# EAGLE design LoRa SX1276 Shield (EAGLE 7.7.0)

## Sheet 1 of 2
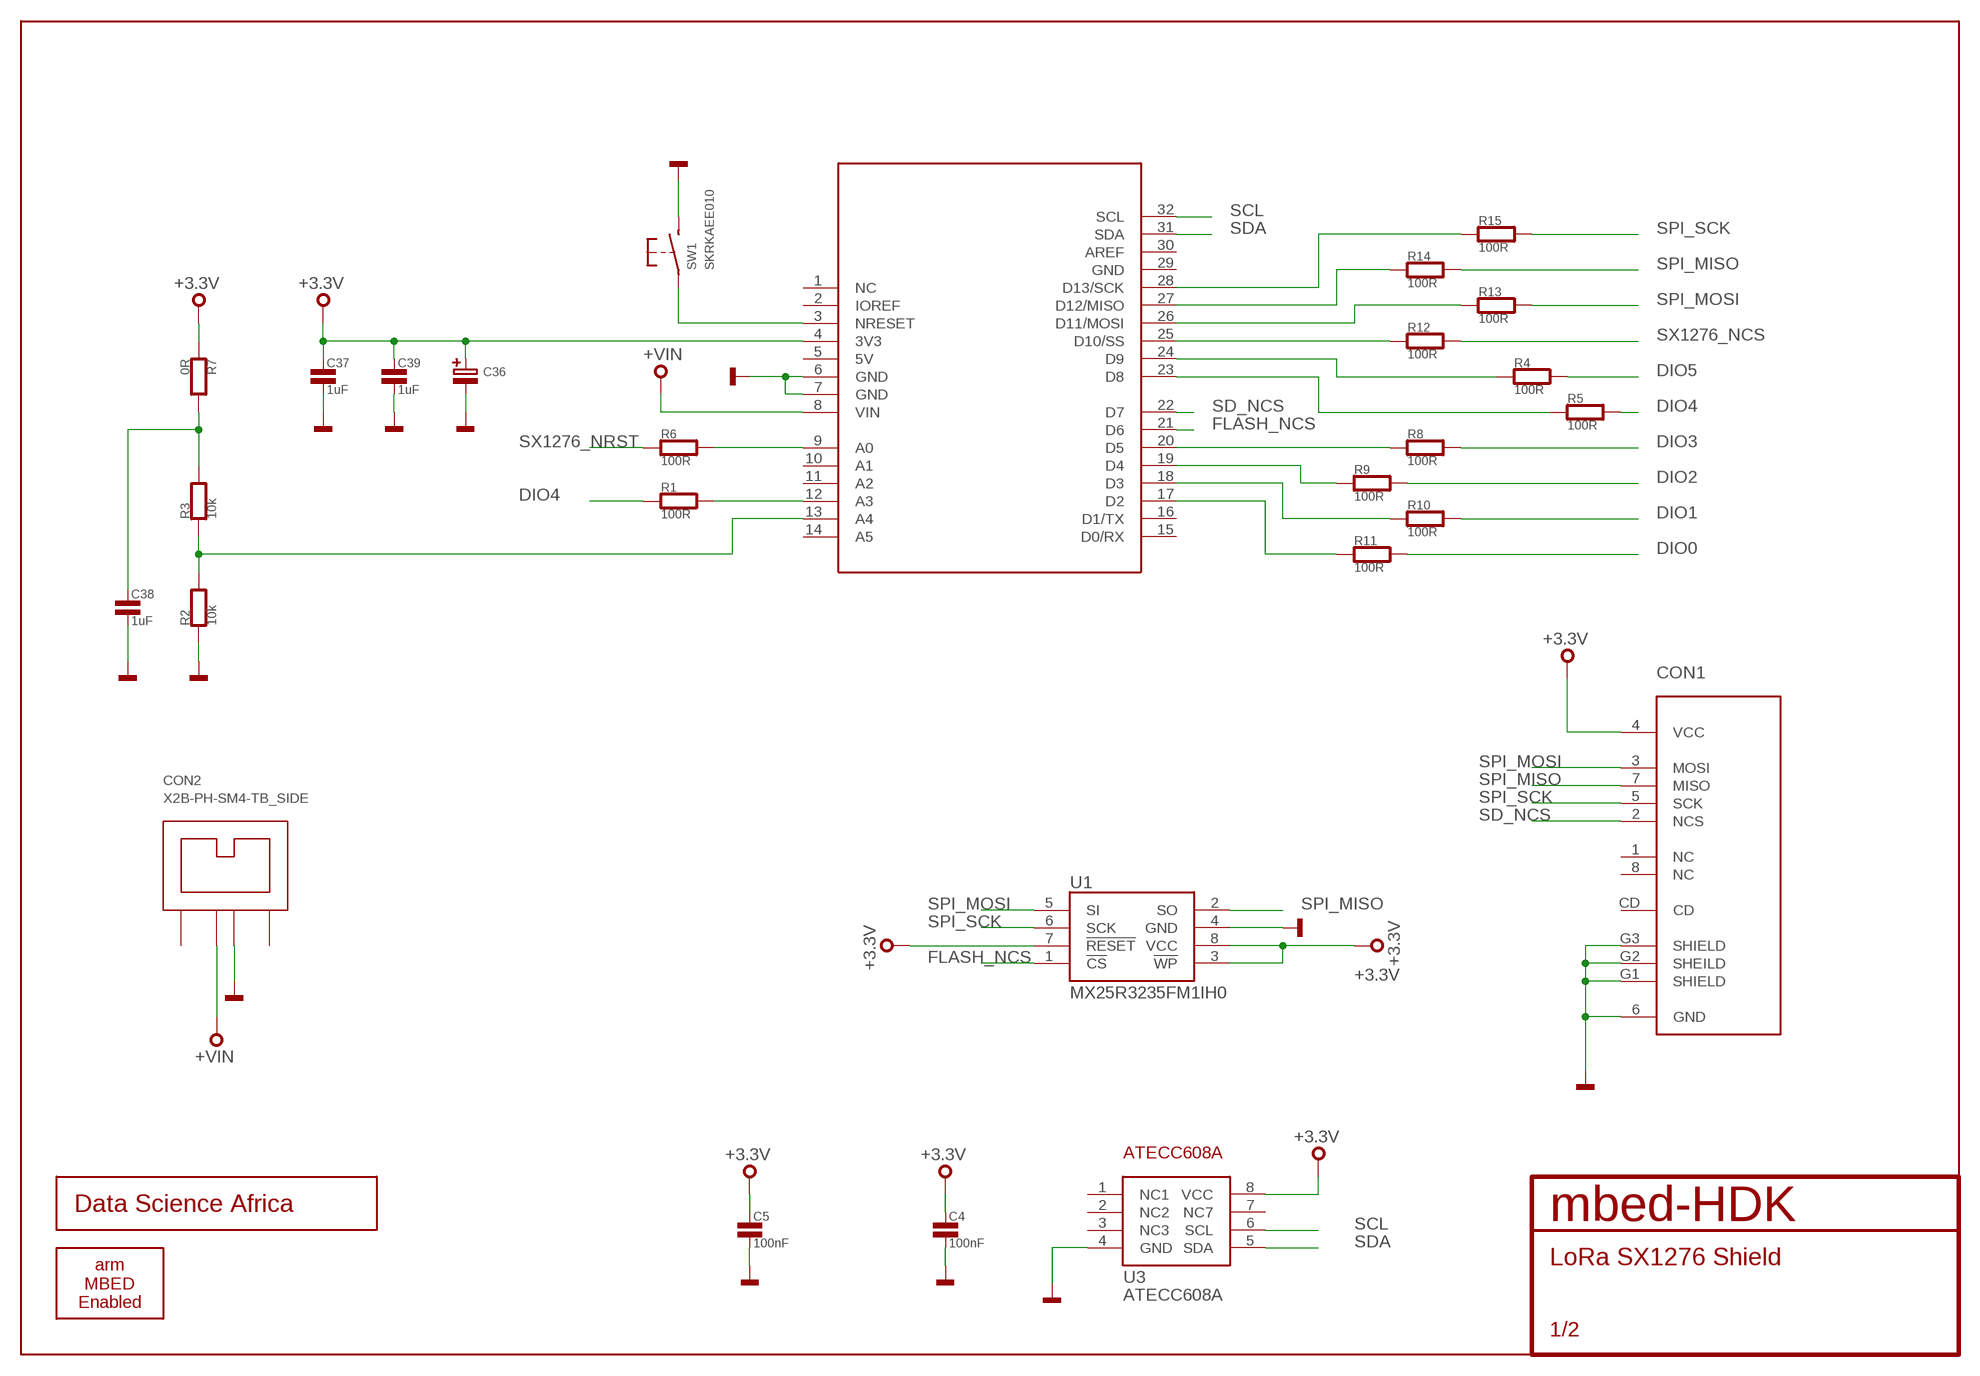
[diagram p0: schematic, sheet 1]

### Parts
BRD2  ARDUINO-R3_APPS  [ARDUINO-R3-APPS-SHEILD]
C4  100nF  C0402  [0402]
C5  100nF  C0402  [0402]
C36  C-POLB  [SMC_B]
C37  1uF  C0603  [0603]
C38  1uF  C0603  [0603]
C39  1uF  C0402  [0402]
CON1  101-00660-68-6  [AMPHENOL-101-00660-68-6]
CON2  X2B-PH-SM4-TB_SIDE  [S2B-PH-SM4-TB]
R1  100R  R0402  [0402]
R2  10k  R0402  [0402]
R3  10k  R0402  [0402]
R4  100R  R0402  [0402]
R5  100R  R0402  [0402]
R6  100R  R0402  [0402]
R7  0R  R0402  [0402]
R8  100R  R0402  [0402]
R9  100R  R0402  [0402]
R10  100R  R0402  [0402]
R11  100R  R0402  [0402]
R12  100R  R0402  [0402]
R13  100R  R0402  [0402]
R14  100R  R0402  [0402]
R15  100R  R0402  [0402]
SS1  ARM-MBED-ENABLED-12MM  [ARM-MBED-ENABLED-12MM]
SS2  DATA-SCIENCE-AFRICA  [DATA-SCIENCE-AFRICA]
SW1  SKRKAEE010  [SKRKAEE010]
U1  MX25R3235FM1IH0  [SO8]
U3  ATECC608A  [SO8]

### Nets
+3.3V: BRD2.4(3V3) C4.1 C5.1 C36.+ C37.1 C39.1 CON1.4(VCC) R7.1 U1.3(!WP) U1.7(!RESET) U1.8(VCC) U3.8(VCC) ; also sheet 2
+VIN: BRD2.8(VIN) CON2.P$1
DIO0: R11.2 ; also sheet 2
DIO1: R10.2 ; also sheet 2
DIO2: R9.2 ; also sheet 2
DIO3: R8.2 ; also sheet 2
DIO4: R1.1 R5.2 ; also sheet 2
DIO5: R4.2 ; also sheet 2
FLASH_NCS: BRD2.21(D6) U1.1(!CS)
GND: BRD2.6(GND) BRD2.7(GND) C4.2 C5.2 C36.- C37.2 C38.2 C39.2 CON1.6(GND) CON1.G1(SHIELD) CON1.G2(SHEILD) CON1.G3(SHIELD) CON2.P$2 R2.1 SW1.P$2(S) U1.4(GND) U3.4(GND) ; also sheet 2
N$11: BRD2.27(D12/MISO) R14.1
N$13: BRD2.26(D11/MOSI) R13.1
N$14: BRD2.25(D10/SS) R12.1
N$17: BRD2.28(D13/SCK) R15.1
N$26: BRD2.9(A0) R6.2
N$27: BRD2.13(A4) R2.2 R3.1
N$28: BRD2.12(A3) R1.2
N$29: BRD2.3(NRESET) SW1.P$1(P)
N$30: BRD2.19(D4) R9.1
N$31: BRD2.18(D3) R10.1
N$32: BRD2.17(D2) R11.1
N$33: BRD2.20(D5) R8.1
N$34: BRD2.24(D9) R4.1
N$35: BRD2.23(D8) R5.1
N$39: C38.1 R3.2 R7.2
SCL: BRD2.32(SCL) U3.6(SCL)
SD_NCS: BRD2.22(D7) CON1.2(NCS)
SDA: BRD2.31(SDA) U3.5(SDA)
SPI_MISO: CON1.7(MISO) R14.2 U1.2(SO) ; also sheet 2
SPI_MOSI: CON1.3(MOSI) R13.2 U1.5(SI) ; also sheet 2
SPI_SCK: CON1.5(SCK) R15.2 U1.6(SCK) ; also sheet 2
SX1276_NCS: R12.2 ; also sheet 2
SX1276_NRST: R6.1 ; also sheet 2
Unconnected: BRD2.1(NC) BRD2.2(IOREF) BRD2.5(5V) BRD2.10(A1) BRD2.11(A2) BRD2.14(A5) BRD2.15(D0/RX) BRD2.16(D1/TX) BRD2.29(GND) BRD2.30(AREF) CON1.1(NC) CON1.8(NC) CON1.CD CON2.G1 CON2.G2 U3.1(NC1) U3.2(NC2) U3.3(NC3) U3.7(NC7)

## Sheet 2 of 2
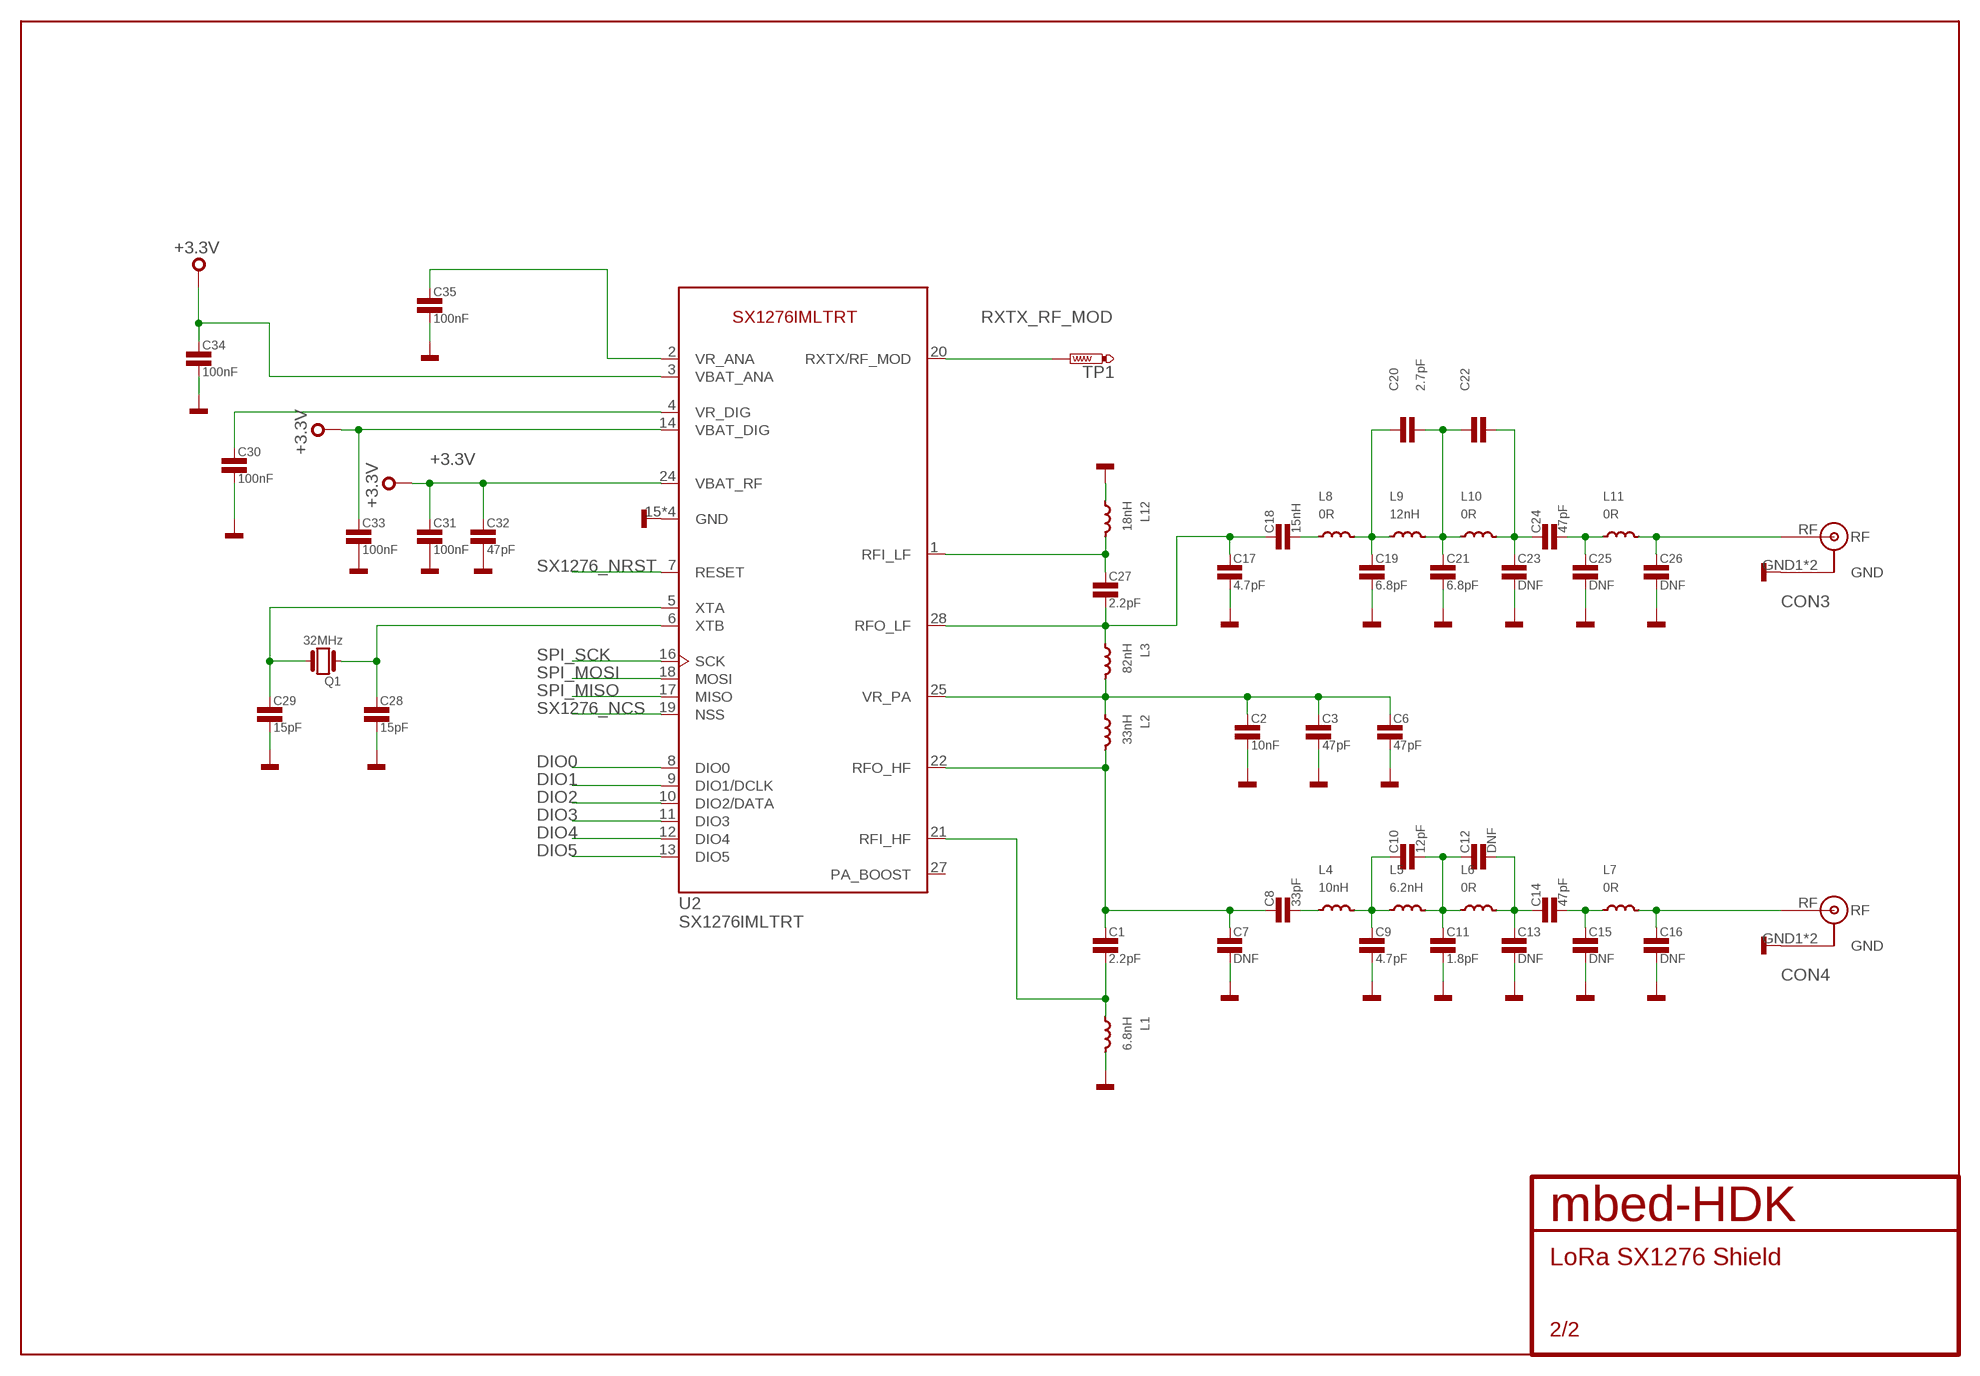
[diagram p1: schematic, sheet 2]

### Parts
C1  2.2pF  C0402  [0402]
C2  10nF  C0402  [0402]
C3  47pF  C0402  [0402]
C6  47pF  C0402  [0402]
C7  DNF  C0402  [0402]
C8  33pF  C0402  [0402]
C9  4.7pF  C0402  [0402]
C10  12pF  C0402  [0402]
C11  1.8pF  C0402  [0402]
C12  DNF  C0402  [0402]
C13  DNF  C0402  [0402]
C14  47pF  C0402  [0402]
C15  DNF  C0402  [0402]
C16  DNF  C0402  [0402]
C17  4.7pF  C0402  [0402]
C18  15nH  C0402  [0402]
C19  6.8pF  C0402  [0402]
C20  2.7pF  C0402  [0402]
C21  6.8pF  C0402  [0402]
C22  C0402  [0402]
C23  DNF  C0402  [0402]
C24  47pF  C0402  [0402]
C25  DNF  C0402  [0402]
C26  DNF  C0402  [0402]
C27  2.2pF  C0402  [0402]
C28  15pF  C0402  [0402]
C29  15pF  C0402  [0402]
C30  100nF  C0402  [0402]
C31  100nF  C0402  [0402]
C32  47pF  C0402  [0402]
C33  100nF  C0402  [0402]
C34  100nF  C0402  [0402]
C35  100nF  C0402  [0402]
CON3  U.FL  [U.FL-R-SMT-1]
CON4  U.FL  [U.FL-R-SMT-1]
L1  6.8nH  L0402  [0402]
L2  33nH  L0402  [0402]
L3  82nH  L0402  [0402]
L4  10nH  L0402  [0402]
L5  6.2nH  L0402  [0402]
L6  0R  L0402  [0402]
L7  0R  L0402  [0402]
L8  0R  L0402  [0402]
L9  12nH  L0402  [0402]
L10  0R  L0402  [0402]
L11  0R  L0402  [0402]
L12  18nH  L0402  [0402]
Q1  32MHz  GENERIC-CRYSTAL_3.2X2.5  [3.2X.2.5]
TP1  PTR1TP12R  [TP12R]
U2  SX1276IMLTRT  [QFN65P600X600X100-29N]

### Nets
+3.3V: C31.1 C32.1 C33.1 C34.1 U2.3(VBAT_ANA) U2.14(VBAT_DIG) U2.24(VBAT_RF) ; also sheet 1
DIO0: U2.8(DIO0) ; also sheet 1
DIO1: U2.9(DIO1/DCLK) ; also sheet 1
DIO2: U2.10(DIO2/DATA) ; also sheet 1
DIO3: U2.11(DIO3) ; also sheet 1
DIO4: U2.12(DIO4) ; also sheet 1
DIO5: U2.13(DIO5) ; also sheet 1
GND: C2.2 C3.2 C6.2 C7.2 C9.2 C11.2 C13.2 C15.2 C16.2 C17.2 C19.2 C21.2 C23.2 C25.2 C26.2 C28.2 C29.2 C30.2 C31.2 C32.2 C33.2 C34.2 C35.2 CON3.GND1(GND) CON3.GND2(GND) CON4.GND1(GND) CON4.GND2(GND) L1.2 L12.1 U2.15(GND) U2.23(GND) U2.26(GND) U2.29(GND) ; also sheet 1
N$1: C1.1 C7.1 C8.1 L2.2 U2.22(RFO_HF)
N$2: C1.2 L1.1 U2.21(RFI_HF)
N$3: C29.1 Q1.P$3 U2.5(XTA)
N$4: C2.1 C3.1 C6.1 L2.1 L3.2 U2.25(VR_PA)
N$5: C27.1 L12.2 U2.1(RFI_LF)
N$6: C8.2 L4.1
N$7: C9.1 C10.1 L4.2 L5.1
N$8: C28.1 Q1.P$1 U2.6(XTB)
N$9: C30.1 U2.4(VR_DIG)
N$10: C10.2 C11.1 C12.1 L5.2 L6.1
N$12: C12.2 C13.1 C14.1 L6.2
N$15: C14.2 C15.1 L7.1
N$16: C16.1 CON4.RF L7.2
N$18: C35.1 U2.2(VR_ANA)
N$19: C17.1 C18.1 C27.2 L3.1 U2.28(RFO_LF)
N$20: C18.2 L8.1
N$21: C19.1 C20.1 L8.2 L9.1
N$22: C20.2 C21.1 C22.1 L9.2 L10.1
N$23: C22.2 C23.1 C24.1 L10.2
N$24: C24.2 C25.1 L11.1
N$25: C26.1 CON3.RF L11.2
RXTX_RF_MOD: TP1.TP U2.20(RXTX/RF_MOD)
SPI_MISO: U2.17(MISO) ; also sheet 1
SPI_MOSI: U2.18(MOSI) ; also sheet 1
SPI_SCK: U2.16(SCK) ; also sheet 1
SX1276_NCS: U2.19(NSS) ; also sheet 1
SX1276_NRST: U2.7(RESET) ; also sheet 1
Unconnected: U2.27(PA_BOOST)

## Library data of the parts
BRD2 = mbed-HDK-misc-Board:ARDUINO-R3: Shield for Arduino R3
C1-C35 C37-C39 = mbed-HDK-RLC:C: Capacitor
C36 = mbed-HDK-RLC:C-POL: Polarised capacitor; MF: Kemet; MFN: T491B106K020AT; OC-DIGIKEY: 399-8298-1-ND; OC-MOUSER: 80-T491B106K020; OC-NEWARK: 57K1740
CON1 = mbed-HDK-Connector:101-00660-68-6: Micro SD PUSH-PUSH; MF: Amphenol; MFN: 101-00660-68-6; OC-DIGIKEY: 101-00660-68-6-1-ND; OC-MOUSER: 523-101-00660-68-6; OC-NEWARK: 47X3171
CON2 = mbed-HDK:X2B-PH-SM4-TB
CON3 CON4 = mbed-HDK-Connector:U.FL
L1-L12 = mbed-HDK-RLC:L: Inductor
Q1 = mbed-HDK-Oscillator:GENERIC-CRYSTAL: GENERIC Crystal
R1-R15 = mbed-HDK-RLC:R: Resistor
SS1 = mbed-HDK-misc-Silkscreen:ARM-MBED-ENABLED
SS2 = mbed-HDK-misc-Silkscreen:DATA-SCIENCE-AFRICA
SW1 = mbed-HDK-Switch:SKRKAEE010: MOMENTARY SWITCH PUSH VERTICAL (SPST); MF: ALPS; MFN: SKRKAEE010; OC-MOUSER: 688-SKRKAE
TP1 = testpad:PTR1: TEST PIN
U1 = mbed-HDK-IC:MX25R3235FM1IH0: Serial Flash 32 Mb 80 Mhz; MF: Macronix; MFN: MX25R3235FM1IH0; OC-DIGIKEY: 1092-1175-ND
U2 = mbed-HDK-IC:SX1276IMLTRT: SX1272 Series 860-1020 MHz 300 kbps Low Power Long Range Transceiver - QFN-28EP; MF: Semtec; MFN: SX1272IMLTRT; OC-DIGIKEY: SX1272IMLTRTCT-ND; OC-MOUSER: 947-SX1272IMLTRT
U3 = mbed-HDK-MF-ATMEL:ATECC608A

## Net classes
0 default: width 0.152 mm, drill 0.203 mm, clearance 0.152 mm

## Board
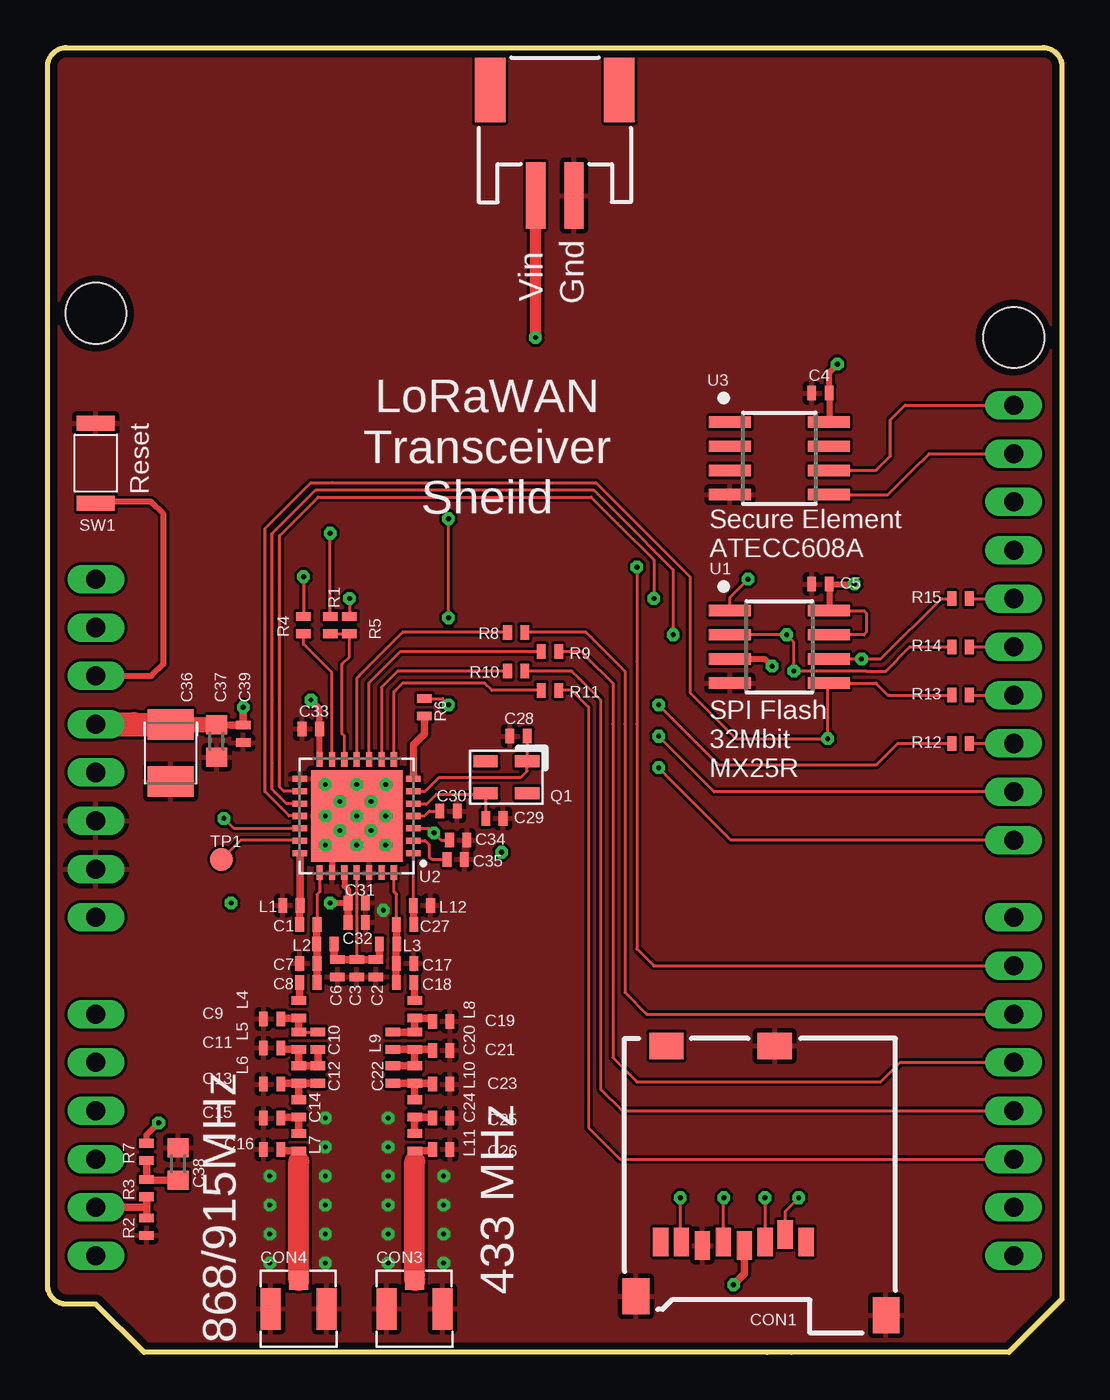
[diagram p2: board, top side]
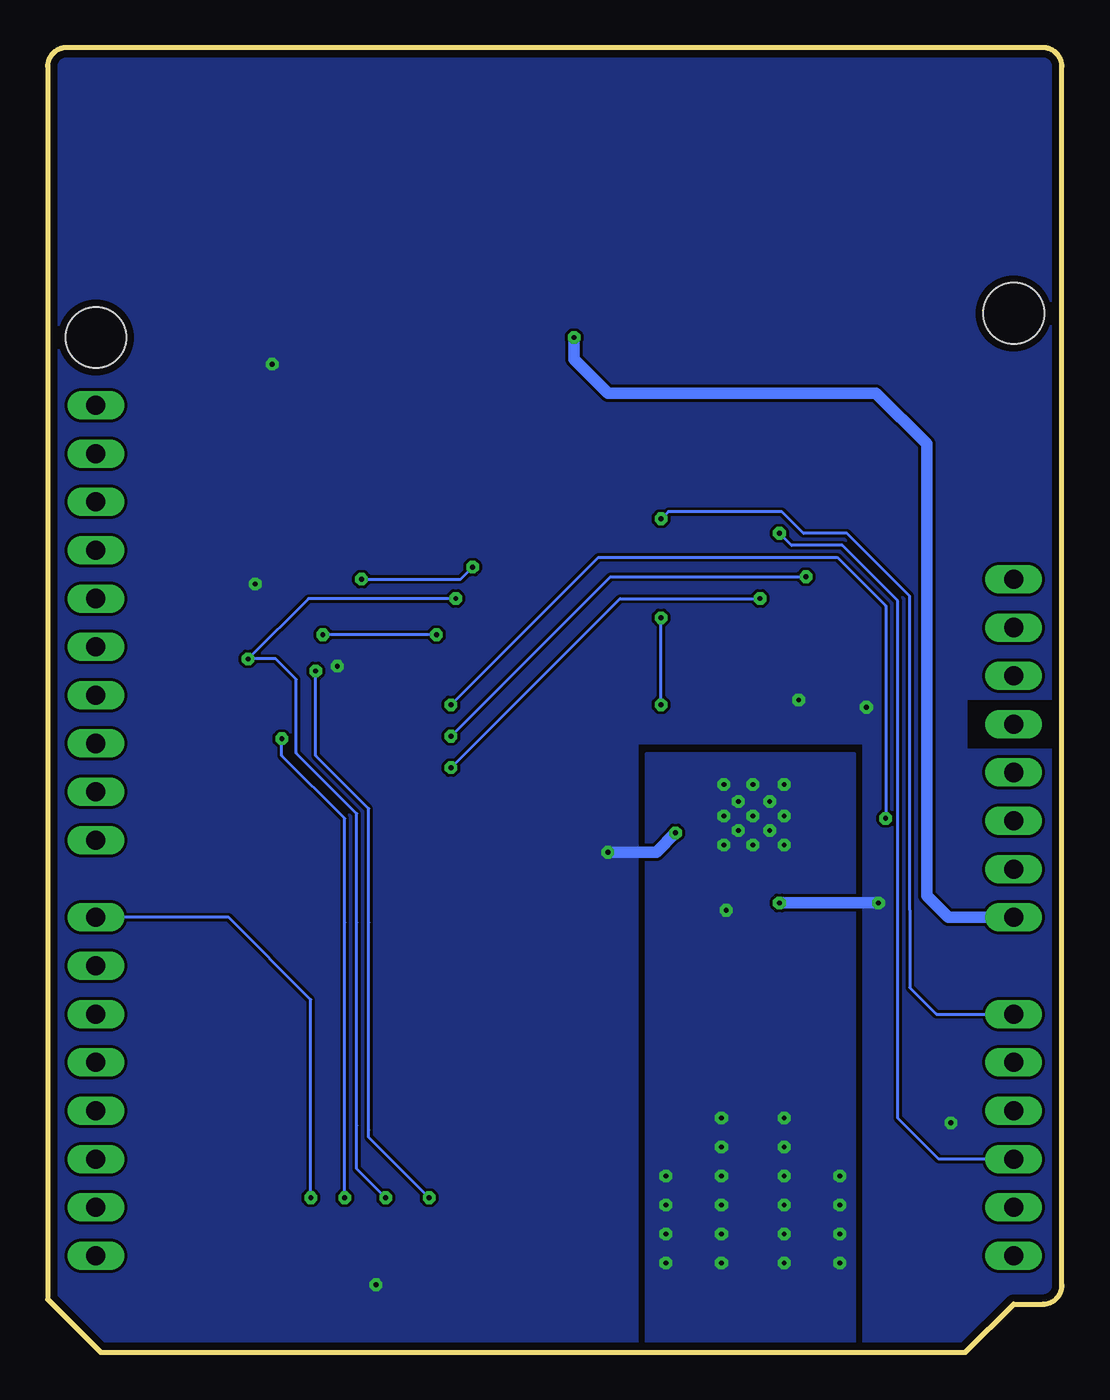
[diagram p3: board, bottom side, seen from below]

Size 53.34 x 68.58 mm. Coordinates in mm from the lower left corner, seen from the top.
Copper layers ((1*16)): Top 0.035mm / dielectric 0.8mm / Bottom 0.035mm
Design rules "mbed-HDK-6-6-2-layer *": minimum track width 6mil, minimum drill 8mil, track to track 6mil, track to pad 6mil, pad to pad 6mil, via to via 6mil, smd to smd 6mil, copper to edge 15mil, drill to drill 8mil, minimum pad ring 10mil, minimum via ring 8mil, stop-mask expansion 4mil, vias tented up to drill 0mil, thermal gap 10mil
bRestrict: area 0,31.8 to 5,34.3

### Footprints (pad centres in the part's own frame; a part is rotated, then mirrored left to right if it is on the bottom)
ARDUINO-R3-APPS-SHEILD = drill 1 long: 1 27.94,2.54; 2 30.48,2.54; 3 33.02,2.54; 4 35.56,2.54; 5 38.1,2.54; 6 40.64,2.54; 7 43.18,2.54; 8 45.72,2.54; 9 50.8,2.54; 10 53.34,2.54; 11 55.88,2.54; 12 58.42,2.54; 13 60.96,2.54; 14 63.5,2.54; 15 63.5,50.8; 16 60.96,50.8; 17 58.42,50.8; 18 55.88,50.8; 19 53.34,50.8; 20 50.8,50.8; 21 48.26,50.8; 22 45.72,50.8; 23 41.656,50.8; 24 39.116,50.8; 25 36.576,50.8; 26 34.036,50.8; 27 31.496,50.8; 28 28.956,50.8; 29 26.416,50.8; 30 23.876,50.8; 31 21.336,50.8; 32 18.796,50.8 | hole 3.2: 15.24,50.8; 13.97,2.54
0402 = smd 0.457 x 0.762: 1 -0.457,0; 2 0.457,0
SMC_B = smd 1.6 x 2.4: + -1.5,0; - 1.5,0
0603 = smd 1 x 1.1: 1 -0.85,0; 2 0.85,0
AMPHENOL-101-00660-68-6 = smd 0.8 x 1.5: 1 -2.55,10.7; 2 -1.45,10.3; 3 -0.4,10.7; 4 0.7,10.9; 5 1.8,10.7; 6 2.9,10.9; 7 4,10.7; 8 5.1,10.7 | smd 1.8 x 1.4: CD 4.8,0.4; G1 -0.9,0.4 | smd 1.4 x 1.9: G2 6.4,13.55; G3 -6.75,14.55
S2B-PH-SM4-TB = smd 1.6 x 3.4: G1 -3.4,7.3; G2 3.4,7.3 | smd 1 x 3.5: P$1 -1,1.75; P$2 1,1.75
U.FL-R-SMT-1 = smd 1.05 x 2.2: GND1 -1.475,0; GND2 1.475,0 | smd 1 x 1: RF 0,-1.5
3.2X.2.5 = smd 1.27 x 0.635: P$1 -1.092,-0.838; P$2 1.092,-0.838; P$3 1.092,0.838; P$4 -1.092,0.838
SKRKAEE010 = smd 0.8 x 2: P$1 -2.1,0; P$2 2.1,0
TP12R = smd 1.2 x 1.2: TP 0,0
SO8 = smd 0.6 x 2.2: 1 -1.905,-2.6; 2 -0.635,-2.6; 3 0.635,-2.6; 4 1.905,-2.6; 5 1.905,2.6; 6 0.635,2.6; 7 -0.635,2.6; 8 -1.905,2.6
QFN65P600X600X100-29N = smd 0.76 x 0.32: 1 -2.98,1.95; 2 -2.98,1.3; 3 -2.98,0.65; 4 -2.98,0; 5 -2.98,-0.65; 6 -2.98,-1.3; 7 -2.98,-1.95; 15 2.98,-1.95; 16 2.98,-1.3; 17 2.98,-0.65; 18 2.98,0; 19 2.98,0.65; 20 2.98,1.3; 21 2.98,1.95 | smd 0.32 x 0.76: 8 -1.95,-2.98; 9 -1.3,-2.98; 10 -0.65,-2.98; 11 0,-2.98; 12 0.65,-2.98; 13 1.3,-2.98; 14 1.95,-2.98; 22 1.95,2.98; 23 1.3,2.98; 24 0.65,2.98; 25 0,2.98; 26 -0.65,2.98; 27 -1.3,2.98; 28 -1.95,2.98 | smd 4.8 x 4.8: 29 0,0

### Placement (x,y rotation side)
BRD2  0,68.58 270 top
C1  13.72,22.48 180 top
C2  17.27,20.19 270 top
C3  16.26,20.19 270 top
C4  40.64,50.42 180 top
C5  40.64,40.39 180 top
C6  15.24,20.19 270 top
C7  13.72,20.45 180 top
C8  13.72,19.43 180 top
C9  11.81,17.53 180 top
C10  14.22,16.38 270 top
C11  11.81,16 180 top
C12  14.22,14.6 270 top
C13  11.81,14.1 180 top
C14  13.21,12.83 270 top
C15  11.81,12.32 180 top
C16  11.81,10.67 180 top
C17  18.8,20.45 0 top
C18  18.8,19.43 0 top
C19  20.7,17.4 0 top
C20  19.3,16.38 270 top
C21  20.7,15.88 0 top
C22  18.16,14.6 270 top
C23  20.7,14.1 0 top
C24  19.3,12.83 270 top
C25  20.7,12.32 0 top
C26  20.7,10.67 0 top
C27  18.8,22.48 180 top
C28  24.77,32.38 180 top
C29  23.5,28.07 0 top
C30  21.08,28.45 0 top
C31  16.26,23.62 0 top
C32  16.26,22.61 0 top
C33  13.84,32.77 180 top
C34  21.59,26.92 0 top
C35  21.46,25.91 0 top
C36  6.48,31.5 270 top
C37  8.89,32.13 270 top
C38  6.86,9.91 90 top
C39  10.29,32.51 270 top
CON1  37.34,16.51 180 top
CON2  26.67,59.05 0 top
CON3  19.3,2.29 180 top
CON4  13.21,2.29 180 top
L1  12.83,23.49 180 top
L2  14.61,21.46 180 top
L3  17.91,21.46 180 top
L4  13.21,18.03 270 top
L5  13.21,16.38 270 top
L6  13.21,14.6 270 top
L7  13.21,11.05 270 top
L8  19.3,18.03 270 top
L9  18.16,16.38 270 top
L10  19.3,14.6 270 top
L11  19.3,11.05 270 top
L12  19.68,23.49 180 top
Q1  24.13,30.23 180 top
R1  14.86,38.23 90 top
R2  5.21,6.6 90 top
R3  5.21,8.64 90 top
R4  13.46,38.23 270 top
R5  15.88,38.23 270 top
R6  19.81,33.91 90 top
R7  5.21,10.54 270 top
R8  24.64,37.85 180 top
R9  26.42,36.83 180 top
R10  24.64,35.81 180 top
R11  26.42,34.8 180 top
R12  48.01,32 180 top
R13  48.01,34.54 180 top
R14  48.01,37.08 180 top
R15  48.01,39.62 180 top
SS1  35.31,54.61 0 top
SS2  6.35,54.99 0 top
SW1  2.54,46.74 90 top
TP1  9.14,25.91 0 top
U1  38.48,37.08 270 top
U2  16.26,28.19 180 top
U3  38.48,46.99 270 top

### Tracks (layer width: path | path; a pad name or v marks a point on that pad's centre or on a via)
+3.3V  (via drill 0.25)
  Top 0.152: U2.3 20.08,27.54 v20.32,27.3 20.7,26.92 C34.1 | 41.1,48.91 U3.8 | U1.8 42.93,38.99 43.05,38.86 43.05,37.85 42.93,37.72 U1.7
  Top 0.305: U2.14 C33.1 14.3,33.83 v13.84,34.29 | v41.53,51.94 41.1,51.51 C4.1 41.1,48.91 | v42.42,40.39 C5.1 41.1,39 U1.8 | U1.3 37.72,36.45 v38.1,36.07 | U2.24 15.61,24.53 15.75,24.38 15.8,24.33 C31.1 v14.86,23.62 | R7.1 5.21,11.43 v5.84,12.06
  Top 0.406: v36.07,3.56 36.64,4.13 CON1.4 | v10.29,33.91 10.29,33.53 C39.1 9.66,32.97 C37.1 | C32.1 C31.1
  Top 0.813: C36.+ 8.62,33 C37.1
  Top 1.27: BRD2.4 4.55,33.02 C36.+
  Bottom 0.61: v23.88,26.29 21.34,26.29 v20.32,27.3 | v14.86,23.62 v9.65,23.62
  pour Bottom: 0,-1.78 10.41,-1.78 10.41,32 22.35,32 22.35,-1.78 53.34,-1.78 53.34,68.58 0,68.58
+VIN  (via drill 0.25)
  Top 0.61: v25.65,53.34 25.65,60.79 CON2.P$1
  Bottom 0.61: BRD2.8 5.97,22.86 7.11,24 7.11,47.75 9.78,50.42 23.88,50.42 25.65,52.2 v25.65,53.34
DIO0
  Top 0.152: R11.2 23.37,34.8 22.99,35.18 18.67,35.18 18.29,34.8 18.21,34.72 U2.8
DIO1
  Top 0.152: R10.2 18.41,35.81 18.16,35.56 17.56,34.95 U2.9
DIO2
  Top 0.152: R9.2 18.54,36.83 16.89,35.18 16.89,31.19 U2.10
DIO3
  Top 0.152: R8.2 18.67,37.85 16.38,35.56 16.26,35.43 U2.11
DIO4
  Top 0.152: U2.12 15.61,32.4 15.49,32.51 15.49,36.2 15.88,36.58 R5.2 R1.1
DIO5
  Top 0.152: U2.13 14.96,35.72 13.46,37.21 R4.2
FLASH_NCS  (via drill 0.25)
  Top 0.152: BRD2.21 31.88,20.32 30.99,21.21 30.99,33.02 30.99,36.32 v30.99,41.27 | U1.1 35.88,39.69 v36.83,40.64
  Bottom 0.152: v36.83,40.64 31.62,40.64 v30.99,41.27
GND  (via drill 0.25)
  Top 0.305: v14.61,26.67 14.96,26.32 U2.23
  other vias: 17.65,23.24 11.68,4.7 11.68,6.22 11.68,7.75 11.68,9.27 14.61,4.7 14.61,6.22 14.61,7.75 14.61,9.27 14.61,10.8 14.61,12.32 17.91,4.7 17.91,6.22 17.91,7.75 17.91,9.27 17.91,10.8 17.91,12.32 20.83,4.7 20.83,6.22 20.83,7.75 20.83,9.27 16.26,28.19 14.61,29.84 16.26,29.84 17.78,29.84 17.02,28.96 17.78,28.19 17.02,27.43 17.78,26.67 16.26,26.67 15.37,27.43 14.61,28.19 15.37,28.96
  pour Top: 0,0 53.34,0 53.34,68.58 0,68.58
  pour Bottom: 10.92,-1.78 21.84,-1.78 21.84,31.5 10.92,31.5
N$1
  Top 0.152: U2.22 14.31,24.21 14.22,24.13 14.17,24.08 C1.1 14.15,22.45 | L2.2 14.17,21.44
  Top 0.406: C8.1 C7.1 14.17,21.44 | L2.2 14.15,22.45 C1.1
N$2
  Top 0.152: U2.21 | L1.1 13.26,23.47
  Top 0.406: C1.2 13.26,23.47 L1.1 U2.21 arc90 U2.21
N$3
  Top 0.152: U2.5 19.95,28.84 20.45,29.34 22.99,29.34 Q1.P$3 C29.1
N$4
  Top 0.152: U2.25 16.26,21.46 C3.1 | C2.1 17.45,20.83 | C6.1 15.06,20.83
  Top 0.406: L2.1 15.06,20.83 arc90 C6.1 C3.1 C2.1 arc90 17.45,20.83 L3.2
N$5
  Top 0.152: U2.1 19.23,26.24 L12.2 19.25,23.47
  Top 0.406: 19.25,23.47 C27.1
N$6
  Top 0.406: C8.2 13.26,18.54 L4.1
N$7
  Top 0.152: L5.1 C10.1
  Top 0.406: C9.1 12.32,17.58 L4.2 L5.1
N$8
  Top 0.152: U2.6 19.84,29.49 20.57,30.23 24.89,30.23 25.15,30.48 25.22,30.56 Q1.P$1 C28.1
N$9
  Top 0.152: U2.4 19.81,28.19 20.07,28.45 C30.1
N$10
  Top 0.152: 13.13,16 L5.2
  Top 0.406: C10.2 C12.1 L6.1 L5.2 12.34,15.93 C11.1
N$11
  Top 0.152: R14.1 BRD2.27
N$12
  Top 0.406: L6.2 C12.2 | L6.2 12.32,14.15 C13.1 | L6.2 C14.1
N$13
  Top 0.152: R13.1 BRD2.26
N$14
  Top 0.152: R12.1 BRD2.25
N$15
  Top 0.406: C15.1 12.32,12.37 C14.2 L7.1
N$16
  Top 0.406: L7.2 12.34,10.59 C16.1
  Top 0.457: 13.21,10.03 L7.2
  Top 1.092: CON4.RF 13.21,10.03
N$17
  Top 0.152: R15.1 BRD2.28
N$18
  Top 0.152: U2.2 19.84,26.89 20.07,26.67 20.07,26.03 20.19,25.91 C35.1
N$19
  Top 0.152: U2.28 18.21,24.21 18.29,24.13 18.34,24.08 C27.2 18.36,22.45 | L3.1 18.34,21.44
  Top 0.406: 18.36,22.45 L3.1 | 18.34,21.44 C17.1 C18.1
N$20
  Top 0.152: C18.2 19.3,19.38
  Top 0.406: 19.3,19.38 L8.1
N$21
  Top 0.406: C19.1 20.07,17.58 L8.2 C20.1 L9.1
N$22
  Top 0.406: C22.1 L10.1 C20.2 | C20.2 20.19,15.93 C21.1 | L9.2 C20.2
N$23
  Top 0.406: C22.2 L10.2 | L10.2 20.19,14.15 C23.1 | L10.2 C24.1
N$24
  Top 0.406: C25.1 20.19,12.37 C24.2 L11.1
N$25
  Top 0.406: L11.2 20.3,10.59 C26.1
  Top 0.457: 19.3,10.03 L11.2
  Top 1.092: CON3.RF 19.3,10.03
N$26  (via drill 0.25)
  Top 0.152: R6.2 20.78,34.37 v21.08,34.04 | v21.08,38.61 v21.08,43.81
  Bottom 0.152: BRD2.9 6.6,17.78 8,19.18 8,23.24 8,29.21 8,39.37 8,39.75 11.3,43.05 13.59,43.05 14.73,44.2 20.7,44.2 v21.08,43.81 | v21.08,34.04 v21.08,38.61
N$27
  Top 0.406: R3.1 5.21,7.62 | 5.21,7.62 R2.2 | BRD2.13 5.21,7.62
N$28  (via drill 0.25)
  Top 0.152: R1.2 v14.86,43.05
  Bottom 0.152: BRD2.12 6.48,10.16 8.64,12.32 8.64,39.5 11.56,42.42 14.22,42.42 v14.86,43.05
N$29
  Top 0.305: BRD2.3 5.46,35.56 6.1,36.2 6.1,44.07 5.46,44.7 2.61,44.7 SW1.P$1
N$30
  Top 0.152: BRD2.19 44.83,15.24 43.81,14.22 30.99,14.22 29.72,15.49 29.72,33.02 29.72,35.18 28.32,36.58 28.07,36.83 R9.1
N$31
  Top 0.152: BRD2.18 30.23,12.7 29.08,13.84 29.08,33.15 29.08,34.29 27.94,35.43 27.56,35.81 R10.1
N$32
  Top 0.152: BRD2.17 30.1,10.16 28.45,11.81 28.45,23.62 28.45,33.91 27.69,34.67 27.56,34.8 R11.1
N$33
  Top 0.152: BRD2.20 31.5,17.78 30.35,18.92 30.35,33.02 30.35,35.81 28.57,37.59 28.32,37.85 R8.1
N$34  (via drill 0.25)
  Top 0.152: BRD2.24 35.05,29.46 v32.13,32.38 | v13.46,40.77 R4.1
  Bottom 0.152: v32.13,32.38 23.75,40.77 v13.46,40.77
N$35  (via drill 0.25)
  Top 0.152: BRD2.23 35.94,26.92 v32.13,30.73 | v15.88,39.62 R5.1
  Bottom 0.152: v32.13,30.73 23.24,39.62 v15.88,39.62
N$39
  Top 0.406: C38.1 5.24,9.06 R3.2 R7.2
RXTX_RF_MOD
  Top 0.152: U2.20 13.25,26.92 10.16,26.92 TP1.TP
SCL
  Top 0.152: U3.6 43.56,46.35 44.32,47.12 44.32,49.02 45.09,49.78 BRD2.32
SD_NCS  (via drill 0.25)
  Top 0.152: CON1.2 38.79,7.42 v39.5,8.13
  Bottom 0.152: v39.5,8.13 39.5,18.54 43.81,22.86 BRD2.22
SDA
  Top 0.152: U3.5 44.2,45.08 45.47,46.35 46.35,47.24 BRD2.31
SPI_MISO  (via drill 0.25)
  Top 0.152: U1.2 v38.86,37.72 39.24,37.34 39.24,36.07 v39.24,35.81 43.05,35.81 44.07,35.81 45.34,37.08 R14.2 | CON1.7 33.27,5.87 v33.27,8.13 | U2.17 12.56,28.84 11.94,29.46 11.81,29.59 11.81,30.99 11.81,34.29 11.81,43.05 14.1,45.34 28.7,45.34 30.1,43.94 32.89,41.15 v32.89,37.72
  Bottom 0.152: v33.27,8.13 36.45,11.3 36.45,11.68 36.45,22.61 36.45,28.57 39.24,31.37 v39.24,35.81 | v32.89,37.72 v38.86,37.72
SPI_MOSI  (via drill 0.25)
  Top 0.152: CON1.3 37.74,8.11 v37.72,8.13 | U2.18 12.7,28.19 11.43,29.46 11.43,31.11 11.43,34.29 11.43,43.31 13.84,45.72 14.99,45.72 28.83,45.72 30.23,44.32 31.5,43.05 33.78,40.77 33.78,34.67 36.2,32.26 v41.02,32.26 41.02,35.12 U1.5 43.56,35.18 44.2,34.54 44.27,34.54 R13.2
  Bottom 0.152: v37.72,8.13 37.72,22.61 37.72,28.07 41.02,31.37 v41.02,32.26
SPI_SCK  (via drill 0.25)
  Top 0.152: U1.6 v42.8,36.45 43.81,36.45 46.99,39.62 R15.2 | CON1.5 35.54,8.11 v35.56,8.13 | U2.16 12.42,29.49 12.19,29.72 12.19,30.86 12.19,34.29 12.19,35.05 12.19,35.56 12.19,37.21 12.19,42.93 14.22,44.96 28.57,44.96 29.97,43.56 31.88,41.66 v31.88,39.62
  Bottom 0.152: v35.56,8.13 37.08,9.65 37.08,11.94 37.08,22.61 37.08,28.32 40.26,31.5 40.26,35.37 41.34,36.45 v42.8,36.45 39.62,39.62 v31.88,39.62
SX1276_NCS  (via drill 0.25)
  Top 0.152: v32.13,34.04 35.31,30.86 43.56,30.86 44.03,31.33 44.7,32 R12.2 | v9.27,28.07 9.79,27.54 U2.19
  Bottom 0.152: v32.13,34.04 24.38,41.78 11.81,41.78 9.27,39.24 v9.27,28.07
SX1276_NRST
  Top 0.406: U2.7 19.24,31.94 19.81,32.51 R6.1

### Text on the board
tPlace: Vin | Gnd | LoRaWAN / Transceiver / Sheild | Reset | Secure Element / ATECC608A | SPI Flash / 32Mbit / MX25R | 433 MHz | 868/915MHz